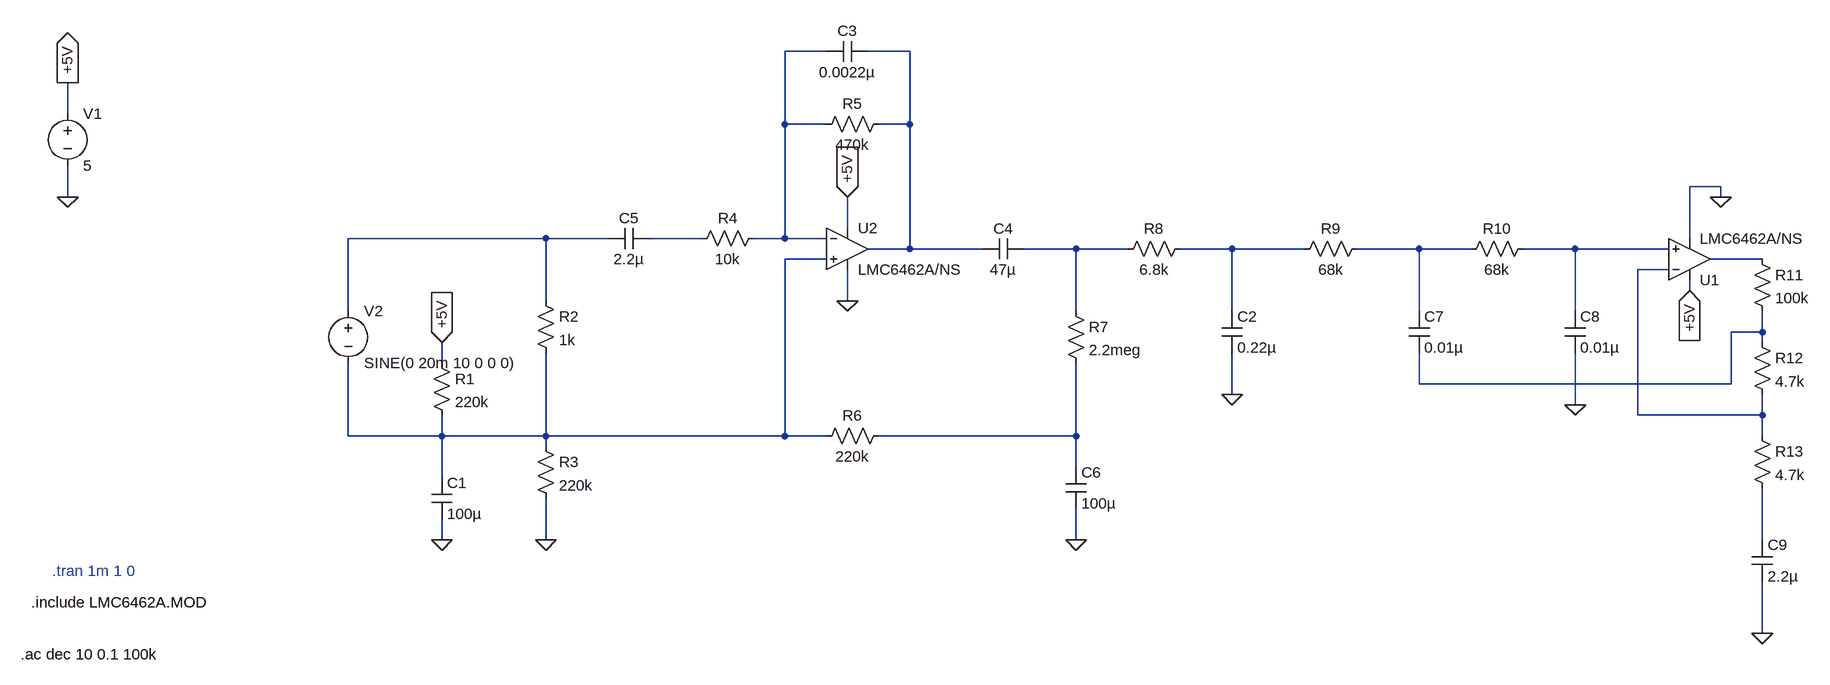
[diagram p0: schematic seis_conditioning.asc]
seis_conditioning.asc, the LTspice schematic file:
Version 4
SHEET 1 2772 852
WIRE 992 -96 928 -96
WIRE 1120 -96 1056 -96
WIRE -176 0 -176 -48
WIRE 928 16 928 -96
WIRE 992 16 928 16
WIRE 1120 16 1120 -96
WIRE 1120 16 1072 16
WIRE 2368 112 2320 112
WIRE -176 128 -176 80
WIRE 2368 128 2368 112
WIRE 1024 176 1024 128
WIRE 560 192 256 192
WIRE 656 192 560 192
WIRE 800 192 720 192
WIRE 928 192 928 16
WIRE 928 192 880 192
WIRE 992 192 928 192
WIRE 2320 192 2320 112
WIRE 1120 208 1120 16
WIRE 1120 208 1056 208
WIRE 1232 208 1120 208
WIRE 1376 208 1296 208
WIRE 1456 208 1376 208
WIRE 1616 208 1536 208
WIRE 1728 208 1616 208
WIRE 1904 208 1808 208
WIRE 1984 208 1904 208
WIRE 2144 208 2064 208
WIRE 2288 208 2144 208
WIRE 992 224 928 224
WIRE 2432 224 2352 224
WIRE 2288 240 2240 240
WIRE 2320 272 2320 256
WIRE 560 288 560 192
WIRE 1024 288 1024 240
WIRE 256 304 256 192
WIRE 1376 304 1376 208
WIRE 1616 304 1616 208
WIRE 1904 304 1904 208
WIRE 2144 304 2144 208
WIRE 2432 336 2432 304
WIRE 2432 336 2384 336
WIRE 2432 352 2432 336
WIRE 400 384 400 352
WIRE 1904 416 1904 368
WIRE 2384 416 2384 336
WIRE 2384 416 1904 416
WIRE 1616 432 1616 368
WIRE 2144 448 2144 368
WIRE 2240 464 2240 240
WIRE 2432 464 2432 432
WIRE 2432 464 2240 464
WIRE 256 496 256 384
WIRE 400 496 400 464
WIRE 400 496 256 496
WIRE 560 496 560 368
WIRE 560 496 400 496
WIRE 928 496 928 224
WIRE 928 496 560 496
WIRE 992 496 928 496
WIRE 1376 496 1376 384
WIRE 1376 496 1072 496
WIRE 2432 496 2432 464
WIRE 560 512 560 496
WIRE 1376 544 1376 496
WIRE 400 560 400 496
WIRE 400 656 400 624
WIRE 560 656 560 592
WIRE 1376 656 1376 608
WIRE 2432 656 2432 576
WIRE 2432 800 2432 720
FLAG 400 656 0
FLAG 560 656 0
FLAG -176 -48 +5V
IOPIN -176 -48 Out
FLAG -176 128 0
FLAG 400 352 +5V
IOPIN 400 352 In
FLAG 1024 288 0
FLAG 1024 128 +5V
IOPIN 1024 128 In
FLAG 1376 656 0
FLAG 2432 800 0
FLAG 2320 272 +5V
IOPIN 2320 272 In
FLAG 2368 128 0
FLAG 2144 448 0
FLAG 1616 432 0
SYMBOL res 384 368 R0
SYMATTR InstName R1
SYMATTR Value 220k
SYMBOL res 544 272 R0
SYMATTR InstName R2
SYMATTR Value 1k
SYMBOL res 544 496 R0
SYMATTR InstName R3
SYMATTR Value 220k
SYMBOL cap 384 560 R0
SYMATTR InstName C1
SYMATTR Value 100µ
SYMBOL voltage -176 -16 R0
SYMATTR InstName V1
SYMATTR Value 5
SYMBOL res 896 176 R90
WINDOW 0 0 56 VBottom 2
WINDOW 3 32 56 VTop 2
SYMATTR InstName R4
SYMATTR Value 10k
SYMBOL opamp2 1024 144 R0
SYMATTR InstName U2
SYMATTR Value LMC6462A/NS
SYMBOL res 1088 0 R90
WINDOW 0 0 56 VBottom 2
WINDOW 3 32 56 VTop 2
SYMATTR InstName R5
SYMATTR Value 470k
SYMBOL cap 1056 -112 R90
WINDOW 0 0 32 VBottom 2
WINDOW 3 32 32 VTop 2
SYMATTR InstName C3
SYMATTR Value 0.0022µ
SYMBOL res 1088 480 R90
WINDOW 0 0 56 VBottom 2
WINDOW 3 32 56 VTop 2
SYMATTR InstName R6
SYMATTR Value 220k
SYMBOL cap 1296 192 R90
WINDOW 0 0 32 VBottom 2
WINDOW 3 32 32 VTop 2
SYMATTR InstName C4
SYMATTR Value 47µ
SYMBOL res 1360 288 R0
SYMATTR InstName R7
SYMATTR Value 2.2meg
SYMBOL cap 1360 544 R0
SYMATTR InstName C6
SYMATTR Value 100µ
SYMBOL opamp2 2320 288 M180
SYMATTR InstName U1
SYMATTR Value LMC6462A/NS
SYMBOL res 2416 208 R0
SYMATTR InstName R11
SYMATTR Value 100k
SYMBOL res 2416 336 R0
SYMATTR InstName R12
SYMATTR Value 4.7k
SYMBOL res 2416 480 R0
SYMATTR InstName R13
SYMATTR Value 4.7k
SYMBOL cap 2416 656 R0
SYMATTR InstName C9
SYMATTR Value 2.2µ
SYMBOL voltage 256 288 R0
SYMATTR InstName V2
SYMATTR Value SINE(0 20m 10 0 0 0)
SYMATTR Value2 AC 1 0
SYMBOL res 1824 192 R90
WINDOW 0 0 56 VBottom 2
WINDOW 3 32 56 VTop 2
SYMATTR InstName R9
SYMATTR Value 68k
SYMBOL res 2080 192 R90
WINDOW 0 0 56 VBottom 2
WINDOW 3 32 56 VTop 2
SYMATTR InstName R10
SYMATTR Value 68k
SYMBOL cap 1888 304 R0
SYMATTR InstName C7
SYMATTR Value 0.01µ
SYMBOL cap 2128 304 R0
SYMATTR InstName C8
SYMATTR Value 0.01µ
SYMBOL res 1552 192 R90
WINDOW 0 0 56 VBottom 2
WINDOW 3 32 56 VTop 2
SYMATTR InstName R8
SYMATTR Value 6.8k
SYMBOL cap 1600 304 R0
SYMATTR InstName C2
SYMATTR Value 0.22µ
SYMBOL cap 720 176 R90
WINDOW 0 0 32 VBottom 2
WINDOW 3 32 32 VTop 2
SYMATTR InstName C5
SYMATTR Value 2.2µ
TEXT -232 752 Left 2 !.include LMC6462A.MOD
TEXT -248 832 Left 2 !.ac dec 10 0.1 100k
TEXT -200 704 Left 2 ;.tran 1m 1 0

The netlist it stands for:
* seis_conditioning.asc
R1 +5V N009 220k
R2 N003 N009 1k
R3 N009 0 220k
C1 N009 0 100µ
V1 +5V 0 5
R4 N001 N004 10k
XU2 N009 N001 +5V 0 N002 LMC6462A/NS  ; pins In+ In- V+ V- OUT
R5 N002 N001 470k
C3 N002 N001 0.0022µ
R6 N013 N009 220k
C4 N005 N002 47µ
R7 N005 N013 2.2meg
C6 N013 0 100µ
XU1 N008 N011 +5V 0 N010 LMC6462A/NS  ; pins In+ In- V+ V- OUT
R11 N010 N012 100k
R12 N012 N011 4.7k
R13 N011 N014 4.7k
C9 N014 0 2.2µ
V2 N003 N009 SINE(0 20m 10 0 0 0) AC 1 0
R9 N007 N006 68k
R10 N008 N007 68k
C7 N007 N012 0.01µ
C8 N008 0 0.01µ
R8 N006 N005 6.8k
C2 N006 0 0.22µ
C5 N004 N003 2.2µ
.include LMC6462A.MOD
.ac dec 10 0.1 100k
* .tran 1m 1 0
.backanno
.end